# Altium schematic sheet PFC.SchDoc
size A3; Organization: Altium Limited; Address1: L3, 12a Rodborough Rd; Address2: Frenchs Forest; Address3: NSW; Address4: Australia 2086
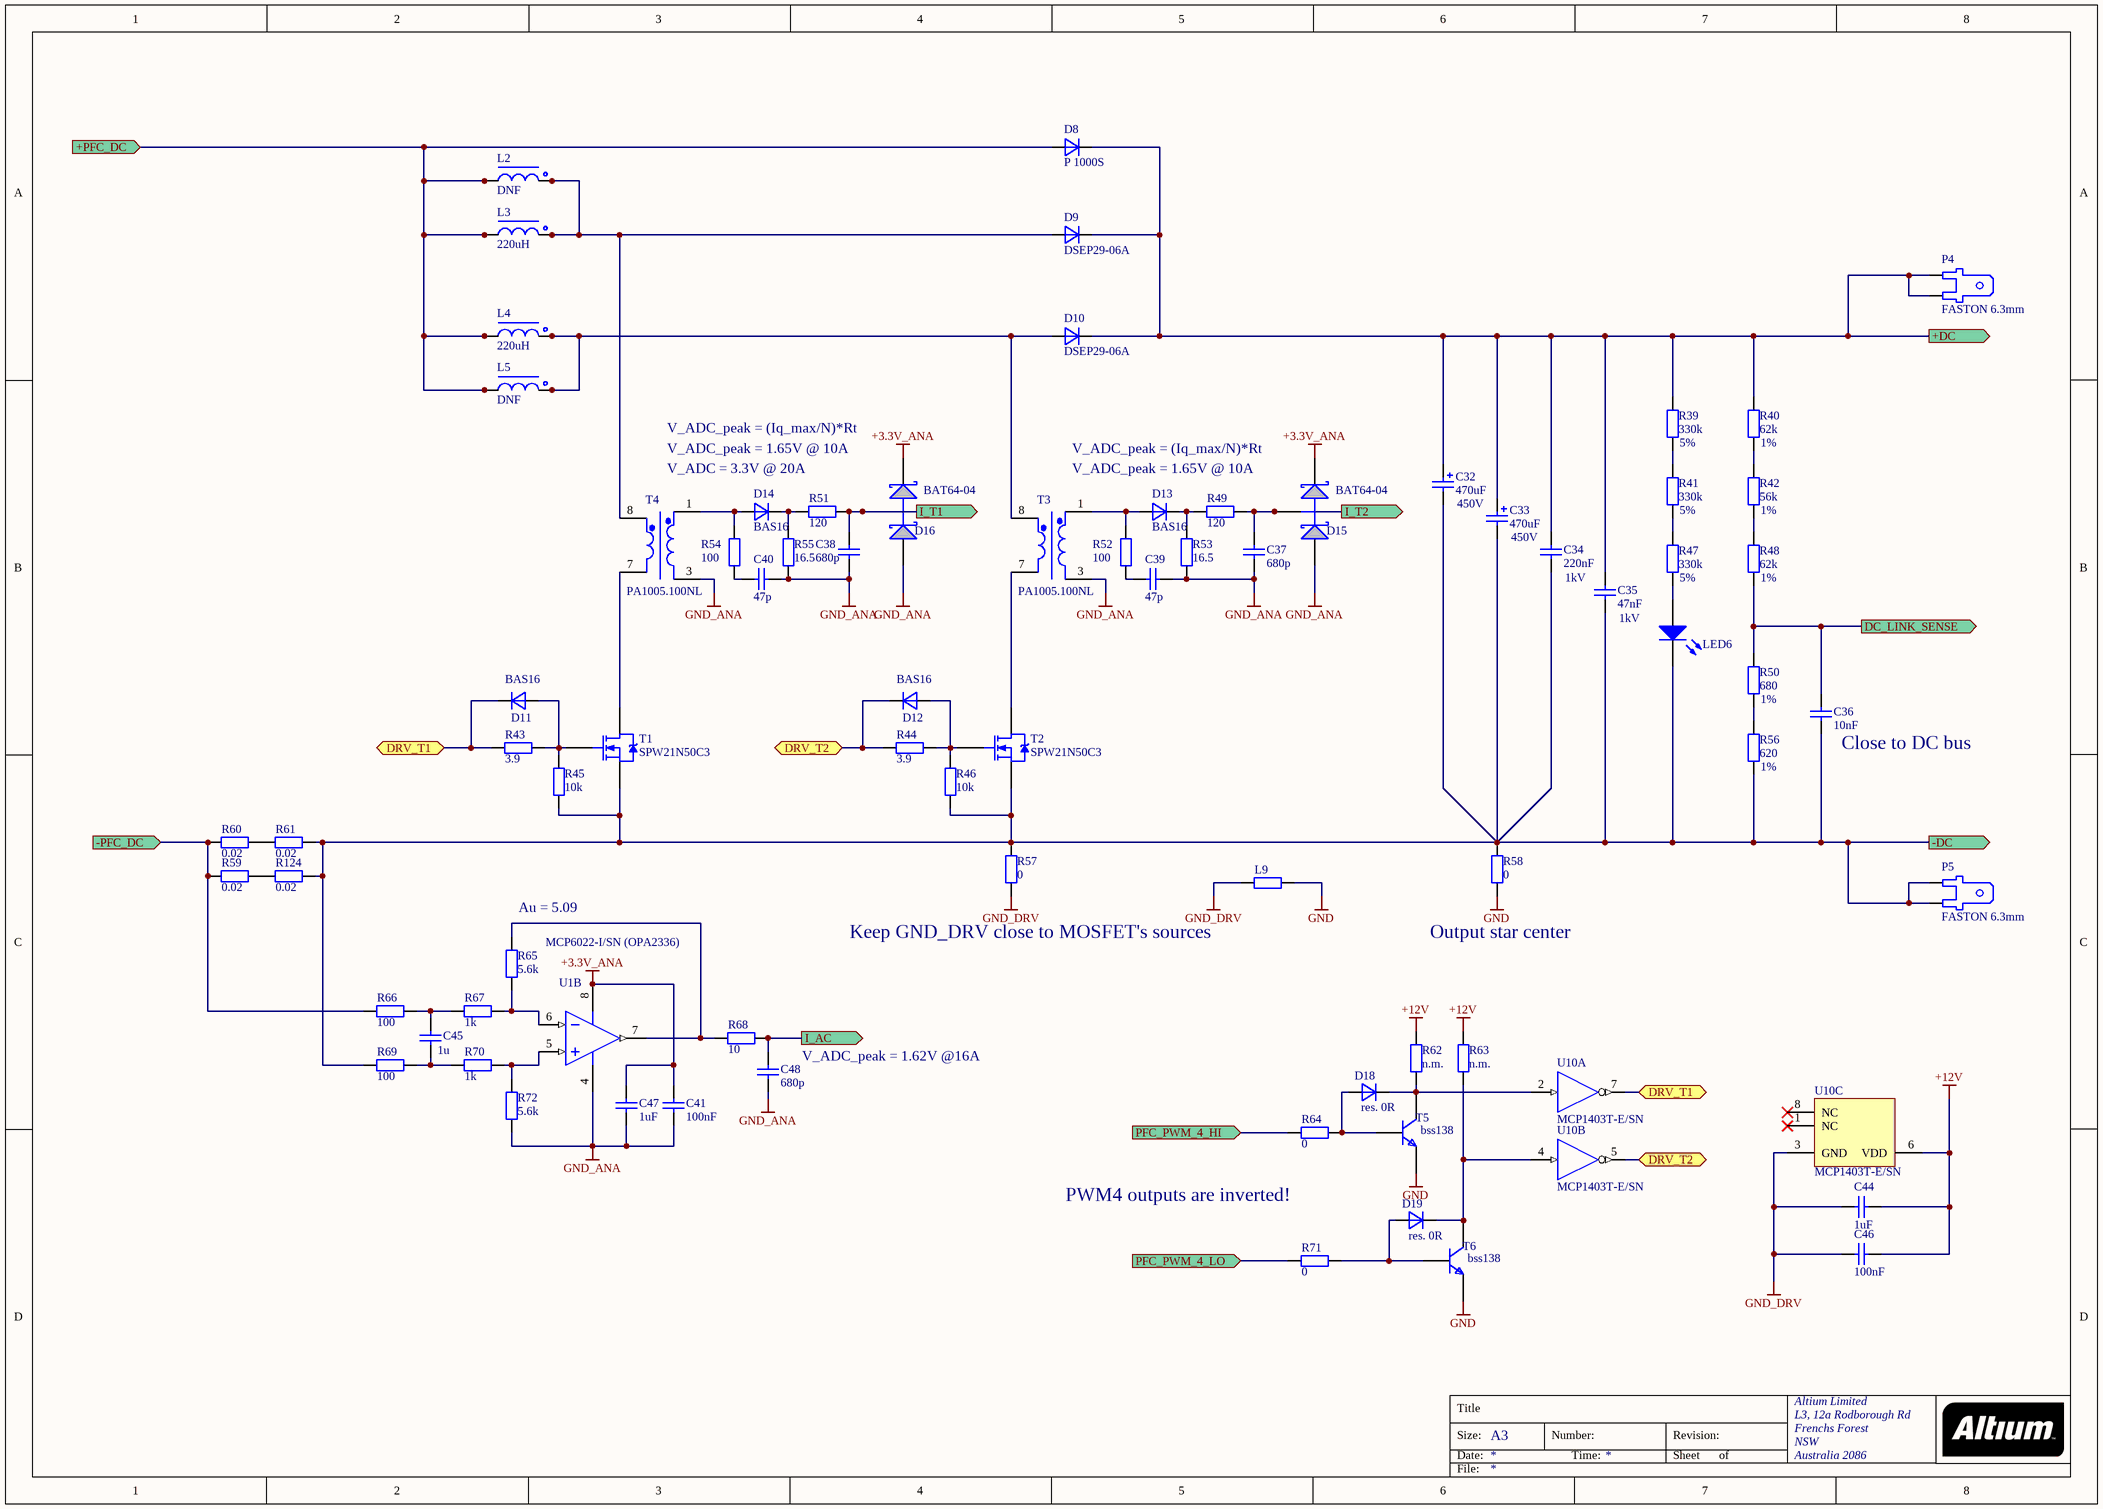
[diagram p0: PFC.SchDoc]

## Parts
C32  value 470uF  Voltage: 450V  [CAPR 52X35]  (hidden comment: Cap)
C33  value 470uF  Voltage: 450V  [CAPR 52X35]  (hidden comment: Cap)
C34  value 220nF  Voltage: 1kV  [RECT 31.0X11.0 RM27.5]  (hidden comment: Cap)
C35  value 47nF  Voltage: 1kV  [RECT 26.5X7.0 RM22.5]  (hidden comment: Cap)
C36  value 10nF  [1206_REFLOW]  (hidden comment: Cap 1206)
C37  value 680p  [1206_REFLOW]  (hidden comment: Cap 1206)
C38  value 680p  [1206_REFLOW]  (hidden comment: Cap 1206)
C39  value 47p  [1206_REFLOW]  (hidden comment: Cap 1206)
C40  value 47p  [1206_REFLOW]  (hidden comment: Cap 1206)
C41  value 100nF  [1206_REFLOW]  (hidden comment: Cap)
C44  value 1uF  [1206_REFLOW]  (hidden comment: Cap 1206)
C45  value 1u  [1206_REFLOW]  (hidden comment: Cap)
C46  value 100nF  [1206_REFLOW]  (hidden comment: Cap 1206)
C47  value 1uF  [1206_REFLOW]  (hidden comment: Cap)
C48  value 680p  [1206_REFLOW]  (hidden comment: Cap)
D8  P 1000S  [P 1000 S]
D9  DSEP29-06A  [Diode TO-220AC-HV]
D10  DSEP29-06A  [Diode TO-220AC-HV]
D11  BAS16  [SOT23_HIS_Primary]
D12  BAS16  [SOT23_HIS_Primary]
D13  BAS16  [SOT23_HIS_Primary]
D14  BAS16  [SOT23_HIS_Primary]
D15  BAT64-04  [SOT23_HIS_Primary]
D16  BAT64-04  [SOT23_HIS_Primary]
D18  value res. 0R  [SOT23_HIS_Primary]  (hidden comment: BAS16)
D19  value res. 0R  [SOT23_HIS_Primary]  (hidden comment: BAS16)
L2  value DNF  [RM-14]  (hidden comment: RM-14 Choke)
L3  value 220uH  [RM-10]  (hidden comment: RM-10 Choke)
L4  value 220uH  [RM-10]  (hidden comment: RM-10 Choke)
L5  value DNF  [RM-14]  (hidden comment: RM-14 Choke)
L9  RES  [1206_REFLOW]  (value not drawn)
LED6  LED  [LED_1206]  (value not drawn)
P4  FASTON 6.3MM  [FASTON 6.3mm]
P5  FASTON 6.3MM  [FASTON 6.3mm]
R39  value 330k  Tolerance: 5%  [RA161004]  (hidden comment: RES)
R40  value 62k  Tolerance: 1%  [RA161004]  (hidden comment: RES)
R41  value 330k  Tolerance: 5%  [RA161004]  (hidden comment: RES)
R42  value 56k  Tolerance: 1%  [RA161004]  (hidden comment: RES)
R43  value 3.9  [1206_REFLOW]  (hidden comment: RES)
R44  value 3.9  [1206_REFLOW]  (hidden comment: RES)
R45  value 10k  [1206_REFLOW]  (hidden comment: RES)
R46  value 10k  [1206_REFLOW]  (hidden comment: RES)
R47  value 330k  Tolerance: 5%  [RA161004]  (hidden comment: RES)
R48  value 62k  Tolerance: 1%  [RA161004]  (hidden comment: RES)
R49  value 120  [1206_REFLOW]  (hidden comment: RES)
R50  value 680  Tolerance: 1%  [RA161004]  (hidden comment: RES)
R51  value 120  [1206_REFLOW]  (hidden comment: RES)
R52  value 100  [1206_REFLOW]  (hidden comment: RES)
R53  value 16.5  [1206_REFLOW]  (hidden comment: RES)
R54  value 100  [1206_REFLOW]  (hidden comment: RES)
R55  value 16.5  [1206_REFLOW]  (hidden comment: RES)
R56  value 620  Tolerance: 1%  [RA161004]  (hidden comment: RES)
R57  value 0  [1206_REFLOW]  (hidden comment: RES)
R58  value 0  [1206_REFLOW]  (hidden comment: RES)
R59  value 0.02  [2512_REFLOW]  (hidden comment: RES)
R60  value 0.02  [2512_REFLOW]  (hidden comment: RES)
R61  value 0.02  [2512_REFLOW]  (hidden comment: RES)
R62  value n.m.  [1206_REFLOW]  (hidden comment: RES)
R63  value n.m.  [1206_REFLOW]  (hidden comment: RES)
R64  value 0  [1206_REFLOW]  (hidden comment: RES)
R65  value 5.6k  [1206_REFLOW]  (hidden comment: RES)
R66  value 100  [1206_REFLOW]  (hidden comment: RES)
R67  value 1k  [1206_REFLOW]  (hidden comment: RES)
R68  value 10  [1206_REFLOW]  (hidden comment: RES)
R69  value 100  [1206_REFLOW]  (hidden comment: RES)
R70  value 1k  [1206_REFLOW]  (hidden comment: RES)
R71  value 0  [1206_REFLOW]  (hidden comment: RES)
R72  value 5.6k  [1206_REFLOW]  (hidden comment: RES)
R124  value 0.02  [2512_REFLOW]  (hidden comment: RES)
T1  value SPW21N50C3  [TO-247HV]  (hidden comment: MOSFET, N, 500V, TO-247)
T2  value SPW21N50C3  [TO-247HV]  (hidden comment: MOSFET, N, 500V, TO-247)
T3  value PA1005.100NL  [PA1005.XXXNL Series]  (hidden comment: PA1005.XXXNL)
T4  value PA1005.100NL  [PA1005.XXXNL Series]  (hidden comment: PA1005.XXXNL)
T5  value bss138  [SOT23_HIS_Primary]  (hidden comment: BC847A)
T6  value bss138  [SOT23_HIS_Primary]  (hidden comment: BC847A)
U1  MCP6022-I/SN (OPA2336)  [SOIC-SN8_N]  (part B of 2)
U10  MCP1403T-E/SN  [SOIC-SN8_N]  (parts A,B,C of 3)

## Ports
+DC (out), +PFC_DC (in), -DC (out), -PFC_DC (in), DC_LINK_SENSE (out), DRV_T1 (bidir), DRV_T2 (bidir), I_AC (out), I_T1 (out), I_T2 (out), PFC_PWM_4_HI (in), PFC_PWM_4_LO (in)

## Nets
+3.3V_ANA: C41.2 C47.2 D15.2(K) D16.2(K) U1.8(VDD)
+12V: C44.1 C46.1 R62.1 R63.1 U10.6(VDD)
GND: L9.2 R58.2 T5.2(E) T6.2(E)
GND_ANA: C37.2 C38.2 C39.1 C40.1 C41.1 C47.1 C48.1 D15.1(A) D16.1(A) R53.1 R55.1 R72.1 T3.3(Sec2+) T4.3(Sec2+) U1.4(VSS)
GND_DRV: C44.2 C46.2 L9.1 R57.2 U10.3(GND)
+DC: C32.1 C33.1 C34.2 C35.2 D8.K D9.1(K) D10.1(K) P4.1 P4.2 R39.1 R40.1 ; port +DC
+PFC_DC: D8.A L2.7 L2.8 L2.9 L2.10 L2.11 L2.12 L3.7 L3.8 L3.9 L3.10 L3.11 L3.12 L4.7 L4.8 L4.9 L4.10 L4.11 L4.12 L5.7 L5.8 L5.9 L5.10 L5.11 L5.12 ; port +PFC_DC
-DC: C32.2 C33.2 C34.1 C35.1 C36.1 LED6.K P5.1 P5.2 R45.1 R46.2 R56.2 R57.1 R58.1 R61.2 R69.1 R124.2 T1.3(S) T2.3(S) ; port -DC
-PFC_DC: R59.1 R60.1 R66.1 ; port -PFC_DC
DC_LINK_SENSE: C36.2 R48.2 R50.1 ; port DC_LINK_SENSE
DRV_T1: D11.3(K) R43.1 U10.7(~{OUTA}) ; port DRV_T1
DRV_T2: D12.3(K) R44.2 U10.5(~{OUTB}) ; port DRV_T2
I_AC: C48.2 R68.1 ; port I_AC
I_T1: C38.1 D16.3(C) R51.1 ; port I_T1
I_T2: C37.1 D15.3(C) R49.1 ; port I_T2
PFC_PWM_4_HI: R64.1 ; port PFC_PWM_4_HI
PFC_PWM_4_LO: R71.1 ; port PFC_PWM_4_LO
NetC39_2: C39.2 R52.1
NetC40_2: C40.2 R54.1
NetC45_1: C45.1 R69.2 R70.1
NetC45_2: C45.2 R66.2 R67.1
NetD9_2: D9.2(A) L2.1 L2.2 L2.3 L2.4 L2.5 L2.6 L3.1 L3.2 L3.3 L3.4 L3.5 L3.6 T4.8(Pri+)
NetD10_2: D10.2(A) L4.1 L4.2 L4.3 L4.4 L4.5 L4.6 L5.1 L5.2 L5.3 L5.4 L5.5 L5.6 T3.8(Pri+)
NetD11_1: D11.1(A) R43.2 R45.2 T1.1(G)
NetD12_1: D12.1(A) R44.1 R46.1 T2.1(G)
NetD13_1: D13.1(A) R52.2 T3.1(Sec1+)
NetD13_3: D13.3(K) R49.2 R53.2
NetD14_1: D14.1(A) R54.2 T4.1(Sec1+)
NetD14_3: D14.3(K) R51.2 R55.2
NetD18_1: D18.1(A) R64.2 T5.1(B)
NetD18_3: D18.3(K) R62.2 T5.3(C) U10.2(INA)
NetD19_1: D19.1(A) R71.2 T6.1(B)
NetD19_3: D19.3(K) R63.2 T6.3(C) U10.4(INB)
NetLED6_A: LED6.A R47.2
NetR39_2: R39.2 R41.1
NetR40_2: R40.2 R42.1
NetR41_2: R41.2 R47.1
NetR42_2: R42.2 R48.1
NetR50_2: R50.2 R56.1
NetR59_2: R59.2 R124.1
NetR60_2: R60.2 R61.1
NetR65_1: R65.1 R67.2 U1.6(VINB-)
NetR65_2: R65.2 R68.2 U1.7(VOUTB)
NetR70_2: R70.2 R72.2 U1.5(VINB+)
NetT1_2: T1.2(D) T4.7(Pri-)
NetT2_2: T2.2(D) T3.7(Pri-)

Not connected (* = marked no-connect by the designer): D11 2(NC); D12 2(NC); D13 2(NC); D14 2(NC); D18 2(NC); D19 2(NC); U10 1(NC)* 8(NC)*

## Notes on the sheet
- V_ADC_peak = (Iq_max/N)*Rt
- V_ADC_peak = 1.65V @ 10A
- V_ADC = 3.3V @ 20A
- (near C36) Close to DC bus
- (near R65) Au = 5.09
- Keep GND_DRV close to MOSFET's sources
- (near R58) Output star center
- V_ADC_peak = 1.62V @16A
- PWM4 outputs are inverted!
- Title
- Size:
- Date:
- A3
- Number:
- Time:
- Revision:
- Sheet
- of
- File:

## Library data of the parts
C32 C33 = Cap pol: Manufacturer: *; Manufacturer Order Code: *; Supplier Order Code: *
C34 = Cap: Manufacturer: EPCOS; Manufacturer Order Code: B32654A224J; Supplier Order Code: 1200806
C35 = Cap: Manufacturer: Epcos; Manufacturer Order Code: B32653A0473K; Supplier Order Code: 9751300
D8 = P 1000S: SEMIKRON - P1000S - DIODE, RECTIFIER, 10A, 1200V, AXIAL; Description: Standard silicon rectifier  diode; Value: P 1000S; Farnell Order Number: 1772102
D9 D10 = DSEP29-06A: HiPerFREDTM Epitaxial Diode with soft recovery; Farnell Order Number: 1427265; Value: DSEP29-06A
D11-D14 D18 D19 = BAS16: DIODE, SINGLE SOT-23; Manufacturer: Any; Group: Discrete; Subgroup1: Small Signal; Order Code: BAS16 SMD (SOT23); Subgroup: Diode; Package: SOT23; Mounting: SMD; Supplier: Comet
  D11-D14: Value: BAS16
D15 D16 = BAT64-04: Silicon Schottky Diodes; Manufacturer: INF; ComponentLink1DescBC: Manufacturer Link; Group: Discrete; Subgroup: Diode; Published: 21-Mar-2003; DatasheetDocument: Oct-1999; PackageDocument: Sep-2001; PackageReference: SOT-23; Publisher: Altium Limited; ComponentLink1URL: http://www.infineon.com/; Value: BAT64-04
L2 L5 = RM-xx Choke: Core Gap: *; Wire Size: *; Turns: *
L3 L4 = RM-xx Choke: Core Gap: 0.75mm; Wire Size: 0.9mm; Turns: 37
L9 R39-R48 R50 R52-R58 R62-R64 R71 = RES 1
  L9 R52-R55 R57 R58: Tolerance: *
LED6 = LED: Value: TBD
R49 R51 R65-R70 R72 = RES 1: Tolerance: 1%
R59-R61 R124 = RES 1: MULTICOMP - MCPWR12FTEA2005 - RESISTOR, 2512, 20M 1%, 1.5W; Manufacturer: WELWYN; Power Rating: 2W; Voltage Rating: 200V; Resistor Case Style: 2512; Tolerance: 1%; Farnell Order Code: 1100060RL
T1 T2 = SPW21N50C3: INFINEON - SPW21N50C3 - MOSFET, N, 500V, TO-247; Farnell Order Code: 1471815
T3 T4 = PA1005.XXXNL Series: Manufacturer: PULSE ELECTRONICS CORPORATION; Current Rating: 20A; Turns Ratio - Primary:Secondary: *; Inductance: *; DC Resistance (DCR): *
T5 T6 = BC847A: NPN General Purpose Amplifier; OriginalName: BC847ALT1; ComponentField7: Published 29-Sep-2000; Group: Discrete; Subgroup: Transistor; Subgroup1: NPN General Purpose; Package: SOT23; Mounting: SMD
U1 = MCP6022-I/SN: Rail-to-Rail Input/Output, 10 MHz Operational Amplifier, 8-Pin SOIC, Industrial Temperature; Published: 29-Jan-2009; DatasheetVersion: revC, Mar-2006; PackageVersion: revAW, Oct-2008; PackageReference: SOIC-SN8; Publisher: Altium Limited; PackageDescription: 8-Lead Plastic Small Outline (SN) - Narrow, 3.90mm Body [SOIC]; Code_JEDEC: MS-012; Code_IPC: SOIC127P600-8; ComponentLink1Description: Manufacturer Link; ComponentLink1URL: http://www.microchip.com; ComponentLink2Description: Datasheet; ComponentLink2URL: http://ww1.microchip.com/downloads/en/DeviceDoc/21685c.pdf; ComponentLink3Description: Packaging Specification; ComponentLink3URL: http://ww1.microchip.com/downloads/en/PackagingSpec/00049AW.pdf
U10 = MCP1403T-E/SN: 4.5A Dual High-Speed Power MOSFET Drivers, Inverting, Extended Temperature, Tape and Reel; Published: 29-Jan-2009; DatasheetVersion: revB, May-2007; PackageVersion: revAW, Oct-2008; PackageReference: SOIC-SN8; Publisher: Altium Limited; PackageDescription: 8-Lead Plastic Small Outline (SN) - Narrow, 3.90mm Body [SOIC]; Code_JEDEC: MS-012; Code_IPC: SOIC127P600-8; ComponentLink1Description: Manufacturer Link; ComponentLink1URL: http://www.microchip.com; ComponentLink2Description: Datasheet; ComponentLink2URL: http://ww1.microchip.com/downloads/en/DeviceDoc/22022b.pdf; ComponentLink3Description: Packaging Specification; ComponentLink3URL: http://ww1.microchip.com/downloads/en/PackagingSpec/00049AW.pdf
C36-C40 C44 C46 = Cap 1206
  C37 C38: Supplier: *; Supplier Order Code: *; Manufacturer: *; Manufacturer Order Code: *; Voltage: *; Tolerance: *; Series: X7R
  C39 C40: Supplier: *; Supplier Order Code: *; Manufacturer: *; Manufacturer Order Code: *; Voltage: *; Tolerance: *; Series: *
C41 C45 C47 C48 = Cap: Voltage: *; Manufacturer: *; Supplier Order Code: *; Manufacturer Order Code: *; Supplier: *
P4 P5 = FASTON 6.3MM: Value: FASTON 6.3mm